# Altium schematic sheet SAMD21_16X10_V2_schematic.SchDoc
size A4
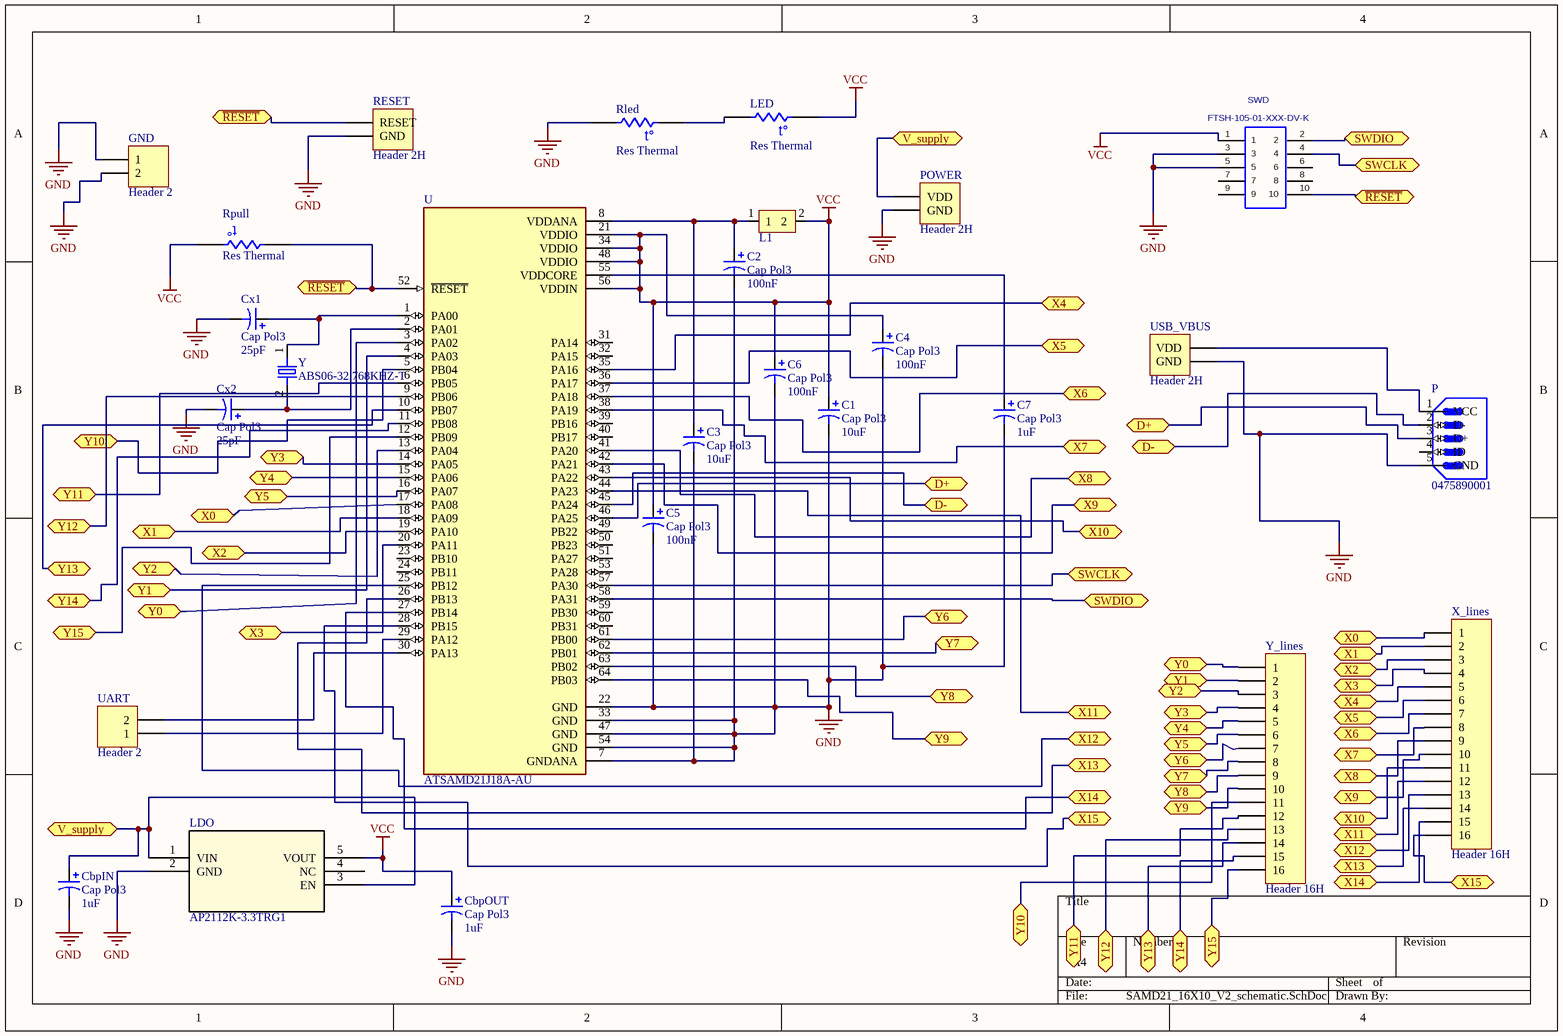
[diagram p0: SAMD21_16X10_V2_schematic.SchDoc]

## Parts
C1  Cap Pol3  value 10uF  [C0805]
C2  Cap Pol3  value 100nF  [C0805]
C3  Cap Pol3  value 10uF  [C0805]
C4  Cap Pol3  value 100nF  [C0805]
C5  Cap Pol3  value 100nF  [C0805]
C6  Cap Pol3  value 100nF  [C0805]
C7  Cap Pol3  value 1uF  [C0805]
CbpIN  Cap Pol3  value 1uF  [C0805]
CbpOUT  Cap Pol3  value 1uF  [C0805]
Cx1  Cap Pol3  value 25pF  [C0805]
Cx2  Cap Pol3  value 25pF  [C0805]
GND  Header 2  [HDR1X2]
L1  SRP4012TA-100M  [Inductor]  (value not drawn)
LDO  AP2112K-3.3TRG1  [SOT_RG1_DIO]
LED  Res Thermal  [6-0805_N]
P  0475890001  [MOLEX_0475890001]
POWER  Header 2H  [HDR1X2H]
RESET  Header 2H  [HDR1X2H]
Rled  Res Thermal  [6-0805_N]
Rpull  Res Thermal  [6-0805_N]
SWD  FTSH-105-01-XXX-DV-K  [FTSH-105-01-XXX-DV-K]
U  ATSAMD21J18A-AU  [QFP80P1600X1600X120-64N]
UART  Header 2  [HDR1X2]
USB_VBUS  Header 2H  [HDR1X2H]
X_lines  Header 16H  [HDR1X16H]
Y  ABS06-32.768KHZ-T  [XTAL_ABS06-32.768KHZ-T]
Y_lines  Header 16H  [HDR1X16H]

## Ports
D+ (bidir), D- (bidir), SWCLK (bidir), SWDIO (bidir), V_supply (bidir), X0 (bidir), X1 (bidir), X2 (bidir), X3 (bidir), X4 (bidir), X5 (bidir), X6 (bidir), X7 (bidir), X8 (bidir), X9 (bidir), X10 (bidir), X11 (bidir), X12 (bidir), X13 (bidir), X14 (bidir), X15 (bidir), Y0 (bidir), Y1 (bidir), Y2 (bidir), Y3 (bidir), Y4 (bidir), Y5 (bidir), Y6 (bidir), Y7 (bidir), Y8 (bidir), Y9 (bidir), Y10 (bidir), Y11 (bidir), Y12 (bidir), Y13 (bidir), Y14 (bidir), Y15 (bidir), ~{RESET} (bidir)

## Nets
GND: C1.2 C2.2 C3.2 C4.2 C5.2 C6.2 C7.2 CbpIN.2 CbpOUT.2 Cx1.2 Cx2.2 GND.1 GND.2 LDO.2(GND) P.5(GND) POWER.2(GND) RESET.2(GND) Rled.2 SWD.3 SWD.5 U.7(GNDANA) U.22(GND) U.33(GND) U.47(GND) U.54(GND) USB_VBUS.1(GND)
VCC: C1.1 C4.1 C5.1 C6.1 CbpOUT.1 L1.2 LDO.5(VOUT) LED.1 Rpull.1 SWD.1 U.21(VDDIO) U.34(VDDIO) U.48(VDDIO) U.56(VDDIN)
D+: P.3(D+) U.46(PA25) ; port D+
D-: P.2(D-) U.45(PA24) ; port D-
~{RESET}: RESET.1(RESET) Rpull.2 SWD.10 U.52(~{RESET}) ; port ~{RESET}
SWCLK: SWD.4 U.57(PA30) ; port SWCLK
SWDIO: SWD.2 U.58(PA31) ; port SWDIO
V_supply: CbpIN.1 LDO.1(VIN) LDO.3(EN) POWER.1(VDD) ; port V_supply
X0: U.17(PA08) X_lines.1 ; port X0
X1: U.18(PA09) X_lines.2 ; port X1
X2: U.19(PA10) X_lines.3 ; port X2
X3: U.20(PA11) X_lines.4 ; port X3
X4: U.35(PA16) X_lines.5 ; port X4
X5: U.36(PA17) X_lines.6 ; port X5
X6: U.37(PA18) X_lines.7 ; port X6
X7: U.38(PA19) X_lines.8 ; port X7
X8: U.41(PA20) X_lines.9 ; port X8
X9: U.42(PA21) X_lines.10 ; port X9
X10: U.43(PA22) X_lines.11 ; port X10
X11: U.44(PA23) X_lines.12 ; port X11
X12: U.25(PB12) X_lines.13 ; port X12
X13: U.26(PB13) X_lines.14 ; port X13
X14: U.27(PB14) X_lines.15 ; port X14
X15: U.28(PB15) X_lines.16 ; port X15
Y0: U.3(PA02) Y_lines.1 ; port Y0
Y1: U.4(PA03) Y_lines.2 ; port Y1
Y2: U.13(PA04) Y_lines.3 ; port Y2
Y3: U.14(PA05) Y_lines.4 ; port Y3
Y4: U.15(PA06) Y_lines.5 ; port Y4
Y5: U.16(PA07) Y_lines.6 ; port Y5
Y6: U.61(PB00) Y_lines.7 ; port Y6
Y7: U.62(PB01) Y_lines.8 ; port Y7
Y8: U.63(PB02) Y_lines.9 ; port Y8
Y9: U.64(PB03) Y_lines.10 ; port Y9
Y10: U.5(PB04) Y_lines.11 ; port Y10
Y11: U.6(PB05) Y_lines.12 ; port Y11
Y12: U.9(PB06) Y_lines.13 ; port Y12
Y13: U.10(PB07) Y_lines.14 ; port Y13
Y14: U.11(PB08) Y_lines.15 ; port Y14
Y15: U.12(PB09) Y_lines.16 ; port Y15
NetC2_1: C2.1 C3.1 L1.1 U.8(VDDANA)
NetC7_1: C7.1 U.55(VDDCORE)
NetCx1_1: Cx1.1 U.1(PA00) Y.1
NetCx2_1: Cx2.1 U.2(PA01) Y.2
NetLED_2: LED.2 Rled.1
NetP_1: P.1(VCC) USB_VBUS.2(VDD)
NetU_29: U.29(PA12) UART.1
NetU_30: U.30(PA13) UART.2

Not connected (* = marked no-connect by the designer): LDO 4(NC); P 4(ID); SWD 6 7 8 9; U 23(PB10) 24(PB11) 31(PA14) 32(PA15) 39(PB16) 40(PB17) 49(PB22) 50(PB23) 51(PA27) 53(PA28) 59(PB30) 60(PB31)

## Notes on the sheet
- (in symbol Res Thermal) t°

## Library data of the parts
C1-C7 CbpIN CbpOUT Cx1 Cx2 = Cap Pol3: Polarized Capacitor (Surface Mount); Published: 8-Jun-2000; LatestRevisionDate: 29-May-2009; LatestRevisionNote: IPC-7351 Footprint Added.; PackageReference: C0805; Publisher: Altium Limited; PackageDescription: Chip Capacitor
GND UART = Header 2: Header, 2-Pin; LatestRevisionDate: 17-Jul-2002; LatestRevisionNote: Re-released for DXP Platform.; Publisher: Altium Limited
L1 = SRP4012TA-100M: Inductor
LDO = AP2112K-3.3TRG1: No Description Available; Vendor: Diodes Inc; Built_By: EMA_Matt; SourceLibrary: Diodes_Inc_2019-12-05; Manufacturer_Part_Number: AP2112K-3.3TRG1; Copyright: Copyright (C) 2018 Accelerated Designs. All rights reserved; RefDes: RefDes; Type: DEV
LED Rled Rpull = Res Thermal: Thermistor; Published: 24-Mar-1999; LatestRevisionDate: 29-May-2009; LatestRevisionNote: IPC-7351 Footprint Added.; PackageVersion: Mar-2003; PackageReference: 6-0805; Publisher: Altium Limited; PackageDescription: Chip Resistor 0805 Case Size; Code_IPC: RESC2012
P = 0475890001: USB - micro AB Receptacle Connector 5 Position Surface Mount, Right Angle; Through Hole; MF: Molex; MP: 0475890001; Digi-Key_Purchase_URL: https://www.digikey.com/product-detail/en/molex/0475890001/WM17143CT-ND/1832255?utm_source=snapeda&utm_medium=aggregator&utm_campaign=symbol; Value: *; Digi-Key_Part_Number: WM17143CT-ND; Package: None; SnapEDA_Link: https://www.snapeda.com/parts/0475890001/Molex/view-part/379420/?ref=snap
POWER RESET USB_VBUS = Header 2H: Header, 2-Pin, Right Angle; LatestRevisionDate: 17-Jul-2002; LatestRevisionNote: Re-released for DXP Platform.; Publisher: Altium Limited
SWD = FTSH-105-01-XXX-DV-K: TERMINAL STRIP, .050"(1.27mm) PITCH, 10 PINS, KEYED; MANUFACTURER: SAMTEC; CREATED: November 30, 2016 - Wendy Xin; PCB DECAL: FTSH-105-01-XXX-DV-K
U = ATSAMD21J18A-AU: ARMÂ® CortexÂ®-M0+ SAM D21J Microcontroller IC 32-Bit 48MHz 256KB _256K x 8_ FLASH 64-TQFP _10x10_; MF: Microchip; Price: None; Value: *; Package: TQFP-64 Microchip; Availability: Unavailable; SnapEDA_Link: https://www.snapeda.com/parts/ATSAMD21J18A-AU/Microchip/view-part/588919/?ref=snap; MP: ATSAMD21J18A-AU
X_lines Y_lines = Header 16H: Header, 16-Pin, Right Angle; LatestRevisionDate: 17-Jul-2002; LatestRevisionNote: Re-released for DXP Platform.; Publisher: Altium Limited
Y = ABS06-32.768KHZ-T: 32.768kHz Â±20ppm Crystal 12.5pF 90 kOhms 2-SMD, No Lead; MF: Abracon; SnapEDA_Link: https://www.snapeda.com/parts/ABS06-32.768KHZ-T/Abracon%20LLC/view-part/108994/?ref=snap; DigiKey-Purchase-URL: https://snapeda.com/shop?store=DigiKey&id=108994; MP: ABS06-32.768KHZ-T; Availability: Unavailable; Price: None; Value: *; Package: SMD-2 Abracon